# Altium schematic sheet Analog_SCH4.SchDoc
size B; Organization: CWRUbotix; Address1: 10900 Euclid Avenue; Address2: Cleveland, OH 44106; Address3: USA
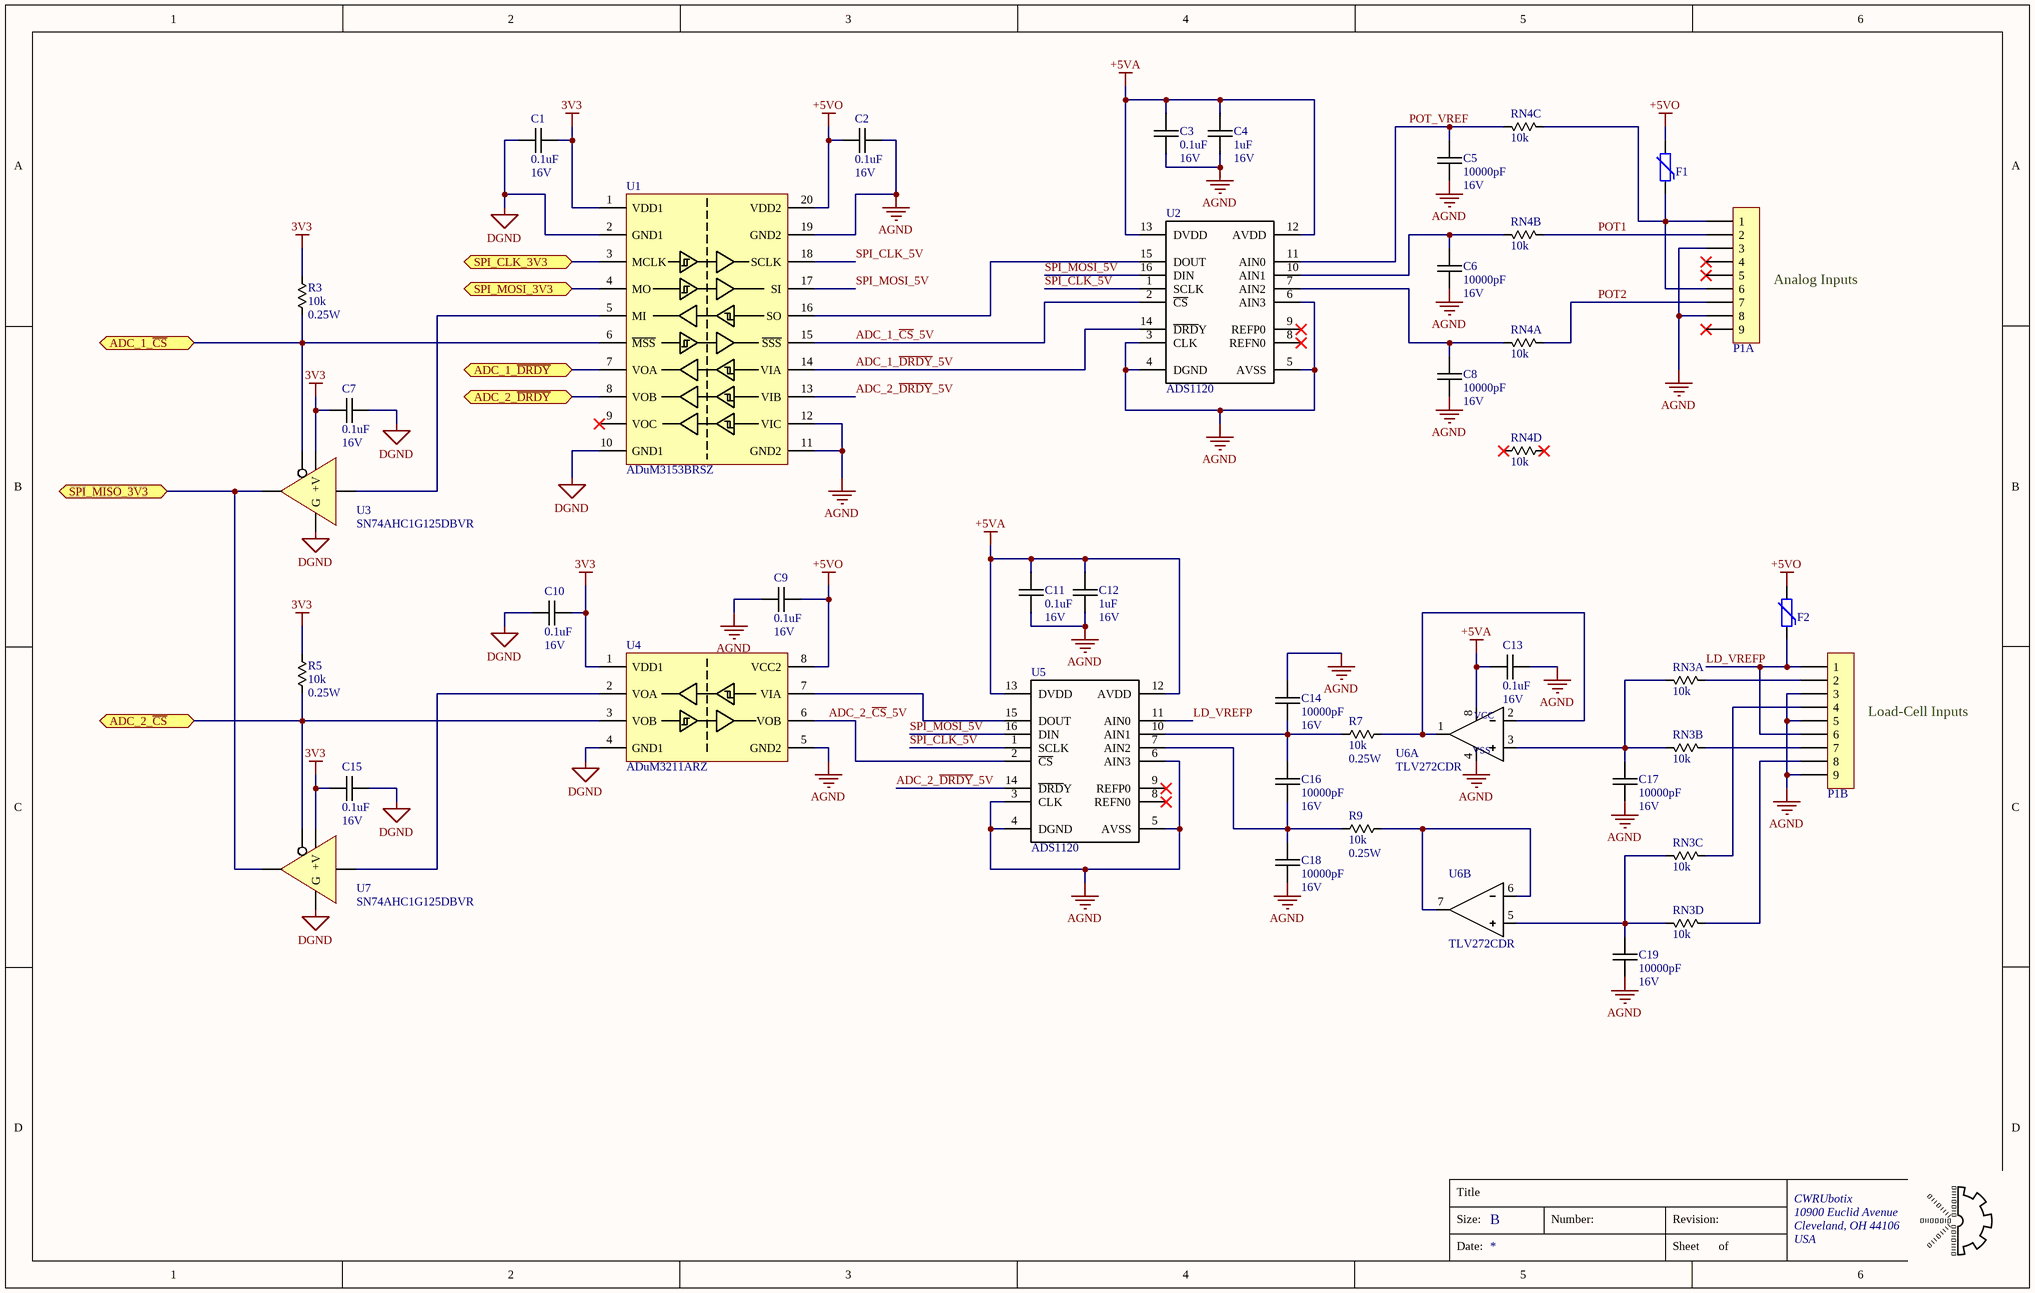
[diagram p0: Analog_SCH4.SchDoc]

## Parts
C1  Capacitance: 0.1uF  Voltage Rating: 16V  [chip_0603]  (hidden comment: cap_single_np)
C2  Capacitance: 0.1uF  Voltage Rating: 16V  [chip_0603]  (hidden comment: cap_single_np)
C3  Capacitance: 0.1uF  Voltage Rating: 16V  [chip_0603]  (hidden comment: cap_single_np)
C4  Capacitance: 1uF  Voltage Rating: 16V  [chip_0805]  (hidden comment: cap_single_np)
C5  Capacitance: 10000pF  Voltage Rating: 16V  [chip_0603]  (hidden comment: cap_single_np)
C6  Capacitance: 10000pF  Voltage Rating: 16V  [chip_0603]  (hidden comment: cap_single_np)
C7  Capacitance: 0.1uF  Voltage Rating: 16V  [chip_0603]  (hidden comment: cap_single_np)
C8  Capacitance: 10000pF  Voltage Rating: 16V  [chip_0603]  (hidden comment: cap_single_np)
C9  Capacitance: 0.1uF  Voltage Rating: 16V  [chip_0603]  (hidden comment: cap_single_np)
C10  Capacitance: 0.1uF  Voltage Rating: 16V  [chip_0603]  (hidden comment: cap_single_np)
C11  Capacitance: 0.1uF  Voltage Rating: 16V  [chip_0603]  (hidden comment: cap_single_np)
C12  Capacitance: 1uF  Voltage Rating: 16V  [chip_0805]  (hidden comment: cap_single_np)
C13  Capacitance: 0.1uF  Voltage Rating: 16V  [chip_0603]  (hidden comment: cap_single_np)
C14  Capacitance: 10000pF  Voltage Rating: 16V  [chip_0603]  (hidden comment: cap_single_np)
C15  Capacitance: 0.1uF  Voltage Rating: 16V  [chip_0603]  (hidden comment: cap_single_np)
C16  Capacitance: 10000pF  Voltage Rating: 16V  [chip_0603]  (hidden comment: cap_single_np)
C17  Capacitance: 10000pF  Voltage Rating: 16V  [chip_0603]  (hidden comment: cap_single_np)
C18  Capacitance: 10000pF  Voltage Rating: 16V  [chip_0603]  (hidden comment: cap_single_np)
C19  Capacitance: 10000pF  Voltage Rating: 16V  [chip_0603]  (hidden comment: cap_single_np)
F1  PTC_0  [chip_1206]  (value not drawn)
F2  PTC_0  [chip_1206]  (value not drawn)
P1  conn-9x1_x2  [D_SUB_9x2_0]  (value not drawn)  (parts A,B of 2)
R3  Resistance: 10k  Power Rating: 0.25W  [chip_0603]  (hidden comment: res_single)
R5  Resistance: 10k  Power Rating: 0.25W  [chip_0603]  (hidden comment: res_single)
R7  Resistance: 10k  Power Rating: 0.25W  [chip_0603]  (hidden comment: res_single)
R9  Resistance: 10k  Power Rating: 0.25W  [chip_0603]  (hidden comment: res_single)
RN3  Resistance: 10k  [chip_1206_arr]  (hidden comment: res_array_4)  (parts A,B,C,D of 4)
RN4  Resistance: 10k  [chip_1206_arr]  (hidden comment: res_array_4)  (parts A,B,C,D of 4)
U1  Manufacturer PN: ADuM3153BRSZ  [tssop-20_0]  (hidden comment: ADuM3153)
U2  ADS1120  [tssop-16_0]
U3  Manufacturer PN: SN74AHC1G125DBVR  [sot-23-5]  (hidden comment: SN74AHCT1G125)
U4  Manufacturer PN: ADuM3211ARZ  [SO-8]  (hidden comment: ADuM3211)
U5  ADS1120  [tssop-16_0]
U6  Manufacturer PN: TLV272CDR  [so-8]  (hidden comment: TLV272DGK)  (parts A,B of 2)
U7  Manufacturer PN: SN74AHC1G125DBVR  [sot-23-5]  (hidden comment: SN74AHCT1G125)

## Ports
ADC_1_~{CS} (bidir), ADC_1_~{DRDY} (bidir), ADC_2_~{CS} (bidir), ADC_2_~{DRDY} (bidir), SPI_CLK_3V3 (bidir), SPI_MISO_3V3 (bidir), SPI_MOSI_3V3 (bidir)

## Nets
3V3: C1.2 C7.2 C10.2 C15.2 R3.2 R5.2 U1.1(VDD1) U3.5(+V) U4.1(VDD1) U7.5(+V)
+5VA: C3.1 C4.2 C11.1 C12.2 C13.2 U2.12(AVDD) U2.13(DVDD) U5.12(AVDD) U5.13(DVDD) U6.8
+5VO: C2.1 C9.2 F1.2 F2.2 U1.20(VDD2) U4.8(VCC2)
AGND: C2.2 C3.2 C4.1 C5.2 C6.2 C8.2 C9.1 C11.2 C12.1 C13.1 C14.1 C17.2 C18.2 C19.2 P1.3 P1.8 P1.12(3) P1.14(5) P1.18(9) U1.11(GND2) U1.12(VIC) U1.19(GND2) U2.3(CLK) U2.4(DGND) U2.5(AVSS) U2.6(AIN3) U4.5(GND2) U5.3(CLK) U5.4(DGND) U5.5(AVSS) U5.6(AIN3) U6.4
DGND: C1.1 C7.1 C10.1 C15.1 U1.2(GND1) U1.10(GND1) U3.3(G) U4.4(GND1) U7.3(G)
ADC_1_~{CS}: R3.1 U1.6(~{MSS}) U3.1(~{OE}) ; port ADC_1_~{CS}
ADC_1_~{CS}_5V: U1.15(~{SSS}) U2.2(~{CS})
ADC_1_~{DRDY}: U1.7(VOA) ; port ADC_1_~{DRDY}
ADC_1_~{DRDY}_5V: U1.14(VIA) U2.14(~{DRD}Y)
ADC_2_~{CS}: R5.1 U4.3(VOB) U7.1(~{OE}) ; port ADC_2_~{CS}
ADC_2_~{CS}_5V: U4.6(VOB) U5.2(~{CS})
ADC_2_~{DRDY}: U1.8(VOB) ; port ADC_2_~{DRDY}
ADC_2_~{DRDY}_5V: U1.13(VIB) U5.14(~{DRD}Y)
LD_VREFP: F2.1 P1.10(1) P1.15(6) U5.11(AIN0)
POT1: P1.2 RN4.2
POT2: P1.7 RN4.1
POT_VREF: C5.1 RN4.6 U2.11(AIN0)
SPI_CLK_3V3: U1.3(MCLK) ; port SPI_CLK_3V3
SPI_CLK_5V: U1.18(SCLK) U2.1(SCLK) U5.1(SCLK)
SPI_MISO_3V3: U3.4(Y) U7.4(Y) ; port SPI_MISO_3V3
SPI_MOSI_3V3: U1.4(MO) ; port SPI_MOSI_3V3
SPI_MOSI_5V: U1.17(SI) U2.16(DIN) U5.16(DIN)
NetC6_1: C6.1 RN4.7 U2.10(AIN1)
NetC8_1: C8.1 RN4.8 U2.7(AIN2)
NetC14_2: C14.2 C16.1 R7.1 U5.10(AIN1)
NetC16_2: C16.2 C18.1 R9.1 U5.7(AIN2)
NetC17_1: C17.1 RN3.7 RN3.8 U6.3
NetC19_1: C19.1 RN3.5 RN3.6 U6.5
NetF1_1: F1.1 P1.1 P1.6 RN4.3
NetP1_11: P1.11(2) RN3.1
NetP1_13: P1.13(4) RN3.3
NetP1_16: P1.16(7) RN3.2
NetP1_17: P1.17(8) RN3.4
NetR7_2: R7.2 U6.1 U6.2
NetR9_2: R9.2 U6.6 U6.7
NetU1_5: U1.5(MI) U3.2(A)
NetU1_16: U1.16(SO) U2.15(DOUT)
NetU4_2: U4.2(VOA) U7.2(A)
NetU4_7: U4.7(VIA) U5.15(DOUT)

Not connected (* = marked no-connect by the designer): P1 4* 5* 9*; RN4 4* 5*; U1 9(VOC)*; U2 8(REFN0)* 9(REFP0)*; U5 8(REFN0)* 9(REFP0)*

## Notes on the sheet
- (near P1) Analog Inputs
- (near P1) Load-Cell Inputs
- Title
- Size:
- B
- Number:
- Revision:
- Date:
- Sheet
- of
- (in symbol ANLG-00030, part A) VCC; VSS

## Library data of the parts
C1-C3 C7 C9-C11 C13 C15 = CAP-00542: CAP, 0.1uF, ±10%, 16V, X7R, 0603; Manufacturer: Murata; Tolerance: ±10%; Part Number: CAP-00542; Type: X7R
C4 C12 = CAP-00107: CAP, 1uF, 10%, 16V, X7R, 0805; Manufacturer: Murata; Manufacturer PN: GRM21BR71C105KA01L; Tolerance: 10%; Part Number: CAP-00107; Type: X7R
C5 C6 C8 C14 C16-C19 = CAP-00543: CAP, 10000pF, ±10%, 16V, X7R, 0603; Tolerance: ±10%; Part Number: CAP-00543; Type: X7R
F1 F2 = MISC-00008: PTC Resettable fuse, 6V, 500mA, 1206; Manufacturer: Eaton; Manufacturer PN: PTS12066V050; TEMP_CO: *; Part Number: MISC-00008; Cost: 0.3
P1 = CONN-00025: D-Sub, Dual 9-pin; Manufacturer PN: 178-009-513R571; Manufacturer: NorComp; Positions per level: 9; Levels: 2; Part Number: CONN-00025; Type: Thru-hole; Cost: 7.32; Weight: 22.69
R3 R5 R7 R9 = RES-00306: RES SMD 10K OHM 1% 1/4W 0603; Manufacturer: Panasonic; Manufacturer PN: ERJ-PA3F1002V; Tolerance: 1%; Part Number: RES-00306; Cost: 0.144
RN3 RN4 = RES-00697: RES ARRAY 4 RES 10k OHM 5% 1/16W 1206; Manufacturer PN: 742C083103JP; Manufacturer: CTS Resistor Products; Tolerance: 0.05; Power Rating: 1/16W; Part Number: RES-00697; Cost: 0.27
U1 = IFACE-00014: Digital Isolator, SPI-bus optomized, ADuM3153; Manufacturer: Analog Devices; Part Number: IFACE-00014; Cost: 6.75
U2 U5 = ANLG-00016: ADC, 16-bit, 4-channel, SPI, 2k SPS, TSSOP-16; Manufacturer: TI; Datasheet Link: http://www.ti.com/lit/ds/symlink/ads1120.pdf; Part Number: ANLG-00016; Manufacturer PN: ADS1120; Cost: 6.8
U3 U7 = LOGIC-00027: Tri-State Buffer, Single, 2-5.5V, SOT-23-5, SN74AHC1G125; Manufacturer: TI; Part Number: LOGIC-00027; Cost: $0.33
U4 = IFACE-00015: Digital Isolator, Dual-Channel, ADuM3211; Manufacturer: Analog Devices; Part Number: IFACE-00015; Cost: 2.87
U6 = ANLG-00030: Op Amp, Dual, Rail-Rail, 3MHZ, SOIC-8; Manufacturer: TI; Part Number: ANLG-00030; Cost: 0.9